# Altium schematic sheet TG21_TX_Xu ly ma tran phim.SchDoc
size A3; SheetNumber: 5; SheetTotal: 6
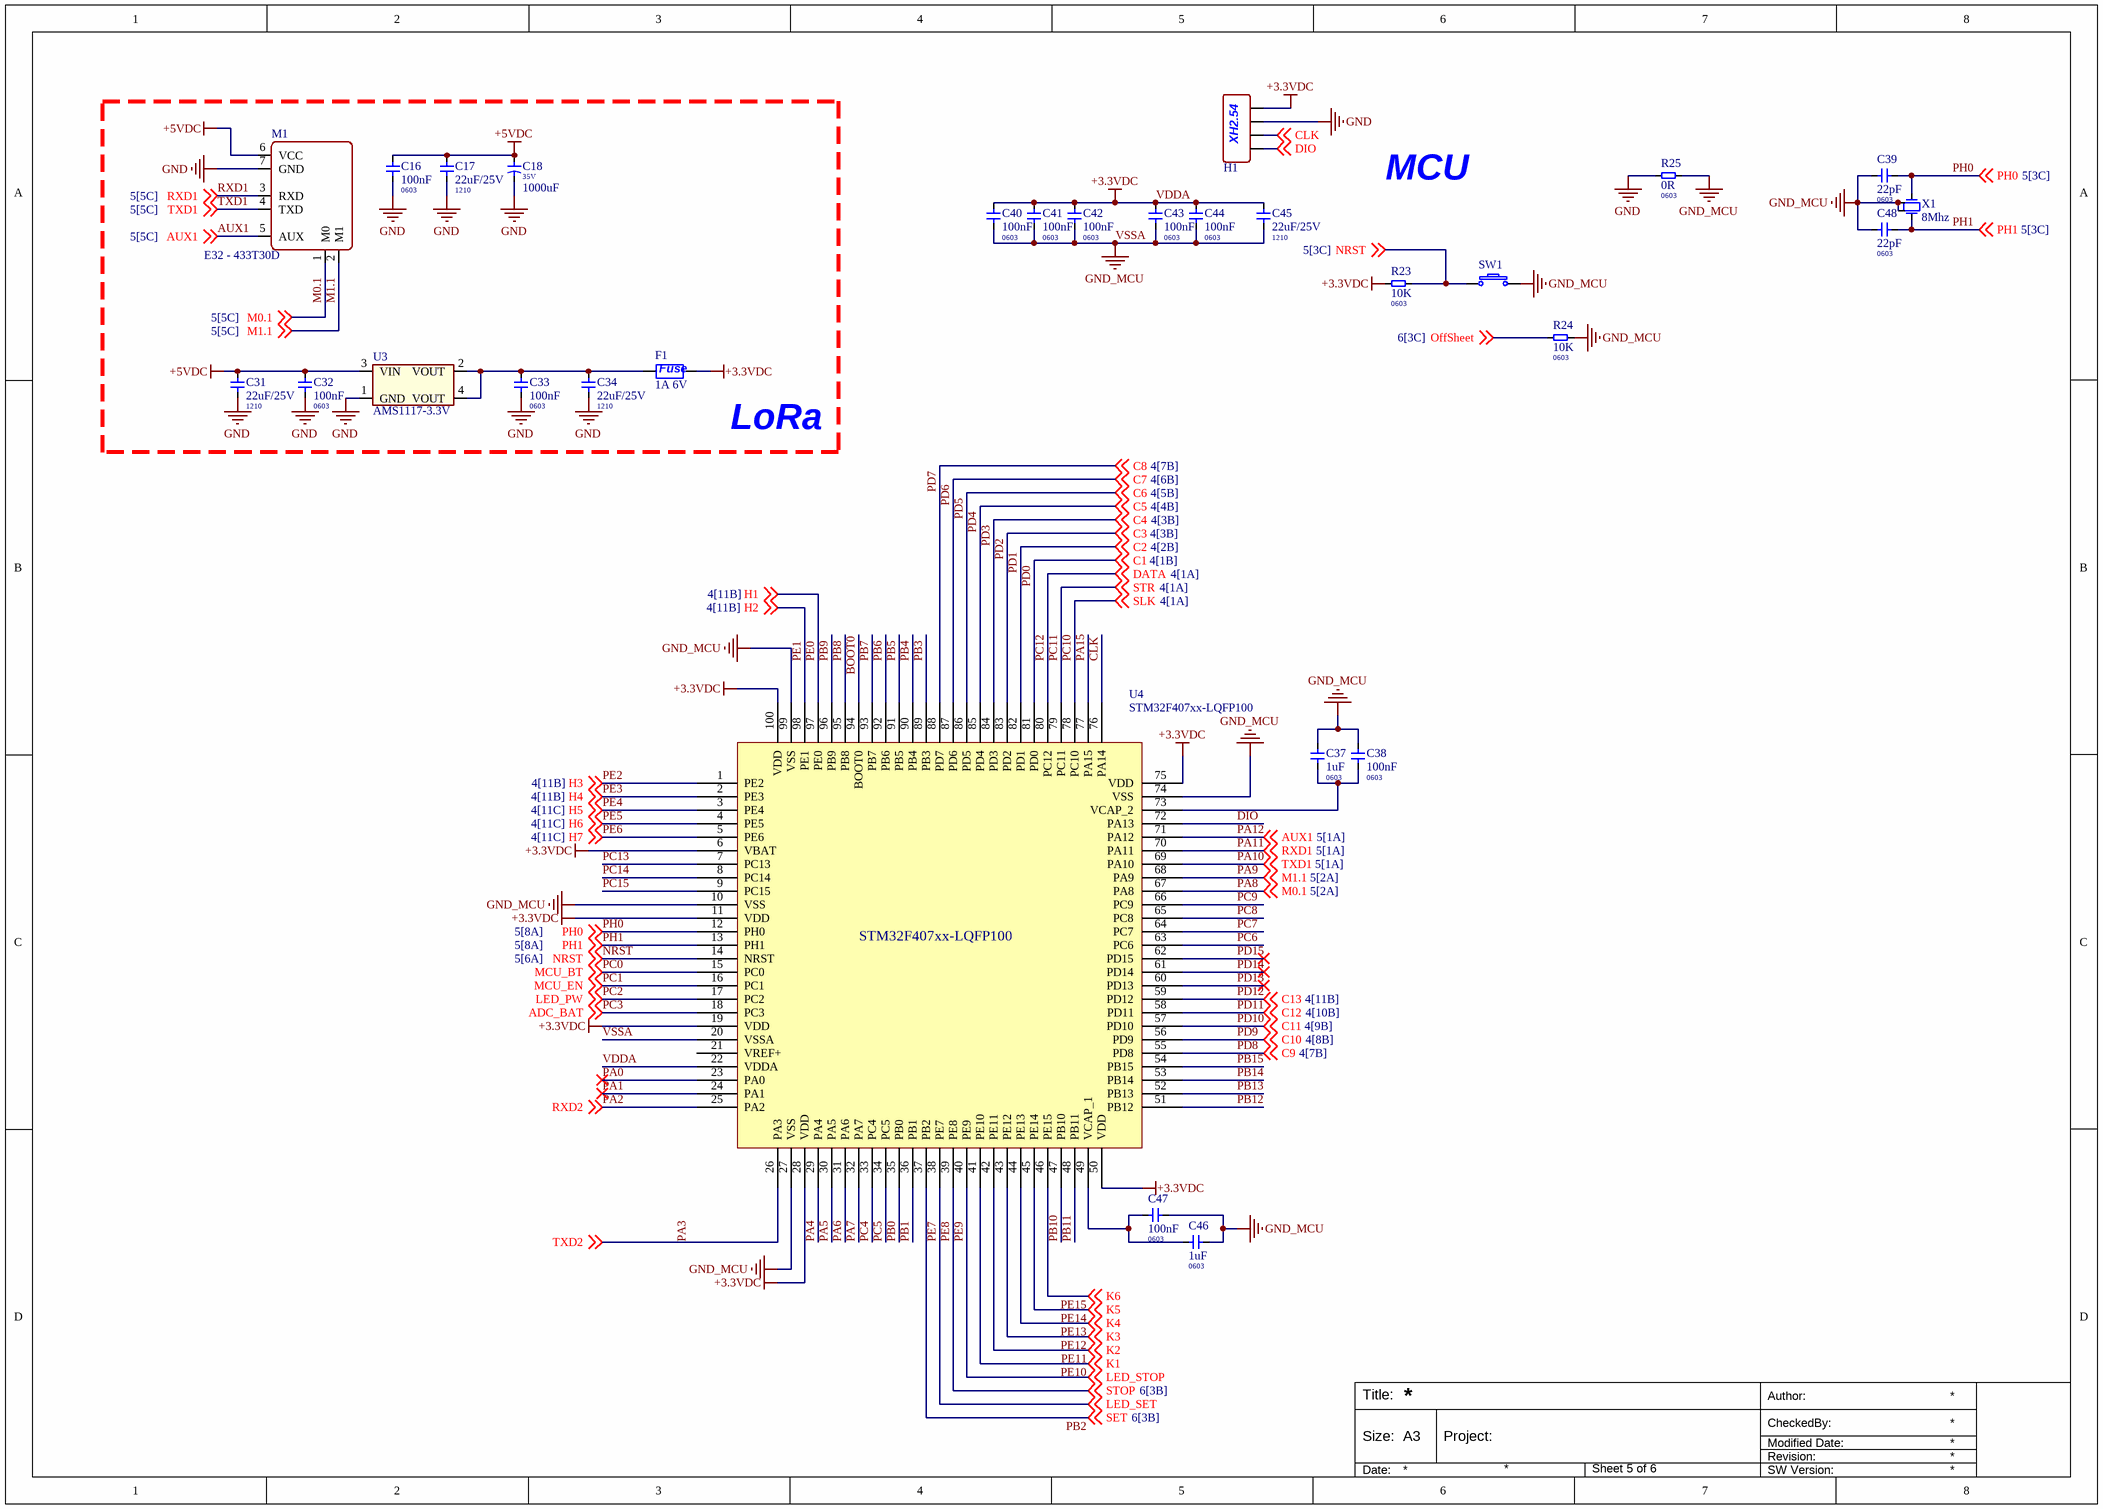
[diagram p0: TG21_TX_Xu ly ma tran phim.SchDoc]

## Parts
C16  100nF  Package: 0603  [0603 MLCC]
C17  22uF/25V  Package: 1210  [1210 CAPACITOR]
C18  Voltage: 35V  Capacitor: 1000uF  [10x20 5.0 Capacitor]  (hidden comment: 1000uF/35V)
C31  22uF/25V  Package: 1210  [1210 CAPACITOR]
C32  100nF  Package: 0603  [0603 MLCC]
C33  100nF  Package: 0603  [0603 MLCC]
C34  22uF/25V  Package: 1210  [1210 CAPACITOR]
C37  1uF  Package: 0603  [0603 MLCC]
C38  100nF  Package: 0603  [0603 MLCC]
C39  22pF  Package: 0603  [0603 MLCC]
C40  100nF  Package: 0603  [0603 MLCC]
C41  100nF  Package: 0603  [0603 MLCC]
C42  100nF  Package: 0603  [0603 MLCC]
C43  100nF  Package: 0603  [0603 MLCC]
C44  100nF  Package: 0603  [0603 MLCC]
C45  22uF/25V  Package: 1210  [1210 CAPACITOR]
C46  1uF  Package: 0603  [0603 MLCC]
C47  100nF  Package: 0603  [0603 MLCC]
C48  22pF  Package: 0603  [0603 MLCC]
F1  1A 6V  [1206 - Fuse]
H1  XY-XH2.54-4PZZ  [XH2.54 - 4PZZ]  (value not drawn)
M1  E32 - 433T30D  [E32 - 433T30D]
R23  10K  Package: 0603  [0603 Resistors]
R24  10K  Package: 0603  [0603 Resistors]
R25  0R  Package: 0603  [0603 Resistors]
SW1  HX 3x6x2.5A-2.5N  [SW - 2P SMD]  (value not drawn)
U3  AMS1117-3.3V  [SOT223 - 4P]
U4  STM32F407xx-LQFP100  [STM32_LQFP100]
X1  8Mhz  [5032 4P]

## Blocks framed on the sheet
LoRa: C16-C18 C31-C34 F1 M1 U3

## Nets
+5VDC: C16.2 C17.2 C18.1 C31.1 C32.2 M1.6(VCC) U3.3(VIN)
GND: C16.1 C17.1 C18.2 C31.2 C32.1 C33.1 C34.2 H1.2 M1.7(GND) R25.1 U3.1(GND)
VDDA: C40.2 C41.2 C42.2 C43.2 C44.2 C45.1 F1.2 H1.1 R23.1 U4.6(VBAT) U4.11(VDD) U4.19(VDD) U4.22(VDDA) U4.28(VDD) U4.50(VDD) U4.75(VDD) U4.100(VDD)  [also labelled +3.3VDC]
VSSA: C37.1 C38.1 C39.2 C40.1 C41.1 C42.1 C43.1 C44.1 C45.2 C46.1 C47.1 C48.2 R24.1 R25.2 SW1.2 U4.10(VSS) U4.20(VSSA) U4.27(VSS) U4.74(VSS) U4.99(VSS) X1.2 X1.4  [also labelled GND_MCU]
AUX1: M1.5(AUX) U4.71(PA12) ; off-sheet AUX1  [also labelled PA12]
BOOT0: U4.94(BOOT0)
CLK: H1.3 U4.76(PA14) ; off-sheet CLK
DIO: H1.4 U4.72(PA13) ; off-sheet DIO
M0.1: M1.1(M0) U4.67(PA8) ; off-sheet M0.1  [also labelled PA8]
M1.1: M1.2(M1) U4.68(PA9) ; off-sheet M1.1  [also labelled PA9]
NRST: R23.2 SW1.1 U4.14(NRST) ; off-sheet NRST
OffSheet: R24.2 ; off-sheet OffSheet
PA0: U4.23(PA0)
PA1: U4.24(PA1)
PA2: U4.25(PA2) ; off-sheet RXD2  [also labelled RXD2]
PA3: U4.26(PA3) ; off-sheet TXD2  [also labelled TXD2]
PA4: U4.29(PA4)
PA5: U4.30(PA5)
PA6: U4.31(PA6)
PA7: U4.32(PA7)
PA10: M1.4(TXD) U4.69(PA10) ; off-sheet TXD1  [also labelled TXD1]
PA11: M1.3(RXD) U4.70(PA11) ; off-sheet RXD1  [also labelled RXD1]
PA15: U4.77(PA15)
PB0: U4.35(PB0)
PB1: U4.36(PB1)
PB2: U4.37(PB2) ; off-sheet SET  [also labelled SET]
PB3: U4.89(PB3)
PB4: U4.90(PB4)
PB5: U4.91(PB5)
PB6: U4.92(PB6)
PB7: U4.93(PB7)
PB8: U4.95(PB8)
PB9: U4.96(PB9)
PB10: U4.47(PB10)
PB11: U4.48(PB11)
PB12: U4.51(PB12)
PB13: U4.52(PB13)
PB14: U4.53(PB14)
PB15: U4.54(PB15)
PC0: U4.15(PC0) ; off-sheet MCU_BT  [also labelled MCU_BT]
PC1: U4.16(PC1) ; off-sheet MCU_EN  [also labelled MCU_EN]
PC2: U4.17(PC2) ; off-sheet LED_PW  [also labelled LED_PW]
PC3: U4.18(PC3) ; off-sheet ADC_BAT  [also labelled ADC_BAT]
PC4: U4.33(PC4)
PC5: U4.34(PC5)
PC6: U4.63(PC6)
PC7: U4.64(PC7)
PC8: U4.65(PC8)
PC9: U4.66(PC9)
PC10: U4.78(PC10) ; off-sheet SLK  [also labelled SLK]
PC11: U4.79(PC11) ; off-sheet STR  [also labelled STR]
PC12: U4.80(PC12) ; off-sheet DATA  [also labelled DATA]
PC13: U4.7(PC13)
PC14: U4.8(PC14)
PC15: U4.9(PC15)
PD0: U4.81(PD0) ; off-sheet C1  [also labelled C1]
PD1: U4.82(PD1) ; off-sheet C2  [also labelled C2]
PD2: U4.83(PD2) ; off-sheet C3  [also labelled C3]
PD3: U4.84(PD3) ; off-sheet C4  [also labelled C4]
PD4: U4.85(PD4) ; off-sheet C5  [also labelled C5]
PD5: U4.86(PD5) ; off-sheet C6  [also labelled C6]
PD6: U4.87(PD6) ; off-sheet C7  [also labelled C7]
PD7: U4.88(PD7) ; off-sheet C8  [also labelled C8]
PD8: U4.55(PD8) ; off-sheet C9  [also labelled C9]
PD9: U4.56(PD9) ; off-sheet C10  [also labelled C10]
PD10: U4.57(PD10) ; off-sheet C11  [also labelled C11]
PD11: U4.58(PD11) ; off-sheet C12  [also labelled C12]
PD12: U4.59(PD12) ; off-sheet C13  [also labelled C13]
PD13: U4.60(PD13)
PD14: U4.61(PD14)
PD15: U4.62(PD15)
PE0: U4.97(PE0) ; off-sheet H1  [also labelled H1]
PE1: U4.98(PE1) ; off-sheet H2  [also labelled H2]
PE2: U4.1(PE2) ; off-sheet H3  [also labelled H3]
PE3: U4.2(PE3) ; off-sheet H4  [also labelled H4]
PE4: U4.3(PE4) ; off-sheet H5  [also labelled H5]
PE5: U4.4(PE5) ; off-sheet H6  [also labelled H6]
PE6: U4.5(PE6) ; off-sheet H7  [also labelled H7]
PE7: U4.38(PE7) ; off-sheet LED_SET  [also labelled LED_SET]
PE8: U4.39(PE8) ; off-sheet STOP  [also labelled STOP]
PE9: U4.40(PE9) ; off-sheet LED_STOP  [also labelled LED_STOP]
PE10: U4.41(PE10) ; off-sheet K1  [also labelled K1]
PE11: U4.42(PE11) ; off-sheet K2  [also labelled K2]
PE12: U4.43(PE12) ; off-sheet K3  [also labelled K3]
PE13: U4.44(PE13) ; off-sheet K4  [also labelled K4]
PE14: U4.45(PE14) ; off-sheet K5  [also labelled K5]
PE15: U4.46(PE15) ; off-sheet K6  [also labelled K6]
PH0: C39.1 U4.12(PH0) X1.3 ; off-sheet PH0
PH1: C48.1 U4.13(PH1) X1.1 ; off-sheet PH1
NetC33_2: C33.2 C34.1 F1.1 U3.2(VOUT) U3.4(VOUT)
NetC37_2: C37.2 C38.2 U4.73(VCAP_2)
NetC46_2: C46.2 C47.2 U4.49(VCAP_1)

Not connected (* = marked no-connect by the designer): U4 21(VREF+)

## Notes on the sheet
- MCU
- Author:
- Title:
- Size:
- A3
- Project:
- Revision:
- Modified Date:
- CheckedBy:
- Date:
- SW Version:
- (in symbol XH2.54 4PZZ) XH2.54

## Library data of the parts
C16 C32 C33 C38 C40-C44 C47 = 0603 100nF: 100nF ±10% 50V Ceramic Capacitor X7R 0603; Manufacturer: YAGEO; Mfr. Part #: CC0603KRX7R9BB104; LCSC Part #: C14663; ComponentLink1Description: LCSC Link; ComponentLink1URL: https://www.lcsc.com/product-detail/C14663.html?s_z=n_0603%2520100nF
C17 C31 C34 C45 = 1210 22uF 25V X7R: 22uF ±10% 25V Ceramic Capacitor X7R 1210; Manufacturer: Samsung Electro-Mechanics; Mfr. Part #: CL32B226KAJNNNE; LCSC Part #: C309062; ComponentLink1Description: LCSC Link; ComponentLink1URL: https://www.lcsc.com/product-detail/C309062.html?s_z=n_22uF%25201210
C18 = 10x20 1000uF 35V: 1000uF 35V Aluminum Electrolytic Capacitors Through Hole,D10xL20mm 2000hrs@105℃; Manufacturer: Rubycon; Mfr. Part #: 35PX1000MEFC10X20; LCSC Part #: C136014; ComponentLink1Description: LCSC Link; ComponentLink1URL: https://www.lcsc.com/product-detail/C136014.html?s_z=n_35V%25201000uF%2520rubycon; Package: Through Hole,D10xL20mm; Type: Capacitor; Assembly Type: DIP Assembly
C37 C46 = 0603 1uF: 1uF ±10% 50V Ceramic Capacitor X5R 0603; Manufacturer: Samsung Electro-Mechanics; Mfr. Part #: CL10A105KB8NNNC; LCSC Part #: C15849; ComponentLink1Description: LCSC Link; ComponentLink1URL: https://www.lcsc.com/product-detail/C15849.html?s_z=n_1uF%25200603%25201%2525&spm=wm.ssy.bg.0.xh&lcsc_vid=FVcIBVBRElIPBFdUFgBYX10HEQJbUQVVQANfV1wFQQcxVlNRQlFeXlNXT1hdUDsOAxUeFF5JWBYZEEoKFBINSQcJGk4%3D
C39 C48 = 0603 22pF: 22pF ±5% 50V Ceramic Capacitor C0G 0603; Manufacturer: Samsung Electro-Mechanics; Mfr. Part #: CL10C220JB8NNNC; LCSC Part #: C1653; ComponentLink1Description: LCSC Link; ComponentLink1URL: https://www.lcsc.com/product-detail/C1653.html?s_z=n_22pF%252050V%25200603
F1 = 1206 Fuse 1A 6V: Polymeric PTC Resettable Fuse 6V 1A Surface Mount 1206; Manufacturer: BHFUSE; Mfr. Part #: BSMD1206-100-6V; LCSC Part #: C883129; Package: 1206; ComponentLink1Description: LCSC Link; ComponentLink1URL: https://www.lcsc.com/product-detail/C883129.html?s_z=n_q_Resettable%2520Fuse%25206V%25201A%25201206&spm=wm.fly.bg.0.xh&lcsc_vid=QQBdBlYAQFFWUgBXTlUPAgFQQQIIBQIHEQIPAgJRQFAxVlNRT1daVVdeT1JfUzsOAxUeFF5JWBYZEEoKFBINSQcJGk4NBhADEA4cHktXRVZADxALGw%3D%3D; ComponentLink2Description: Datasheet; ComponentLink2URL: NO; Type: Fuse; Assembly Type: SMT Assembly
H1 = XH2.54 4PZZ: XH 1 4P -25℃~+85℃ 2.54mm 4 2A 250V 1x4P Through Hole,P=2.54mm Headers, Male Pins RoHS; Manufacturer: XYECONN; Mfr. Part #: XY-XH2.54-4PZZ; LCSC Part #: C53201003; ComponentLink1Description: LCSC Link; ComponentLink1URL: https://www.lcsc.com/product-detail/C53201003.html?s_z=n_XH2.54%25204P; Package: Through Hole,P=2.54mm; Type: Header; Assembly Type: DIP Assembly; ComponentLink2Description: Datasheet; ComponentLink2URL: https://www.lcsc.com/datasheet/C53201003.pdf
M1 = E32 - 433T30D: 8km UART Through Hole RF Transceiver Modules and Modems RoHS; Manufacturer: EBYTE; Mfr. Part #: E32-433T30D; LCSC Part #: C97351; Package: Through Hole; Type: Module; ComponentLink1Description: LCSC Link; ComponentLink1URL: https://www.lcsc.com/product-detail/C97351.html?s_z=n_E32%2520433T30D; ComponentLink2Description: Datasheet; ComponentLink2URL: https://www.lcsc.com/datasheet/C97351.pdf
R23 R24 = 0603 10K: 100mW 10kΩ 75V Thick Film Resistor ±1% ±100ppm/℃ 0603 Chip Resistor - Surface Mount RoHS; Manufacturer: VISHAY; Mfr. Part #: CRCW060310K0FKEA; LCSC Part #: C844918; ComponentLink1Description: LCSC Link; ComponentLink1URL: https://www.lcsc.com/product-detail/C844918.html?s_z=n_10K
R25 = 0603 0R: 100mW 0Ω 75V Thick Film Resistor ±1% ±100ppm/℃ 0603 Chip Resistor - Surface Mount RoHS; Mfr. Part #: RC0603FR-070RL; Manufacturer: YAGEO; LCSC Part #: C100044; ComponentLink1Description: LCSC Link; ComponentLink1URL: https://www.lcsc.com/product-detail/C100044.html?s_z=n_0R%25201%2525%25200603&spm=wm.ssy.bg.1.xh&lcsc_vid=FVcIBVBRElIPBFdUFgBYX10HEQJbUQVVQANfV1wFQQcxVlNRQ1RWVFVVRFVbUzsOAxUeFF5JWBYZEEoKFBINSQcJGk4dAgUUFAk%3D; Value: 0R
SW1 = Switch Tactile 3x6x2.5: Tactile Switch SPST 250gf 2.5mm SMD (SMT) Tab 6mm x 3.6mm Surface Mount; Manufacturer: hanxia; Mfr. Part #: HX 3x6x2.5A-2.5N; LCSC Part #: C36498960; Package: SMD,6x3mm; ComponentLink1Description: LCSC Link; ComponentLink1URL: https://www.lcsc.com/product-detail/C36498960.html?s_z=n_q_p_3x6x2.5&spm=wm.ssy.bg.0.xh&lcsc_vid=QQBdBlYAQFFWUgBXTlUPAgFQQQIIBQIHEQIPAgJRQFAxVlNRT1daU1NWQVBbVTsOAxUeFF5JWBYZEEoKFBINSQcJGk4NBhADEA4cHktXRVZADxALGw%3D%3D; ComponentLink2Description: Datasheet; ComponentLink2URL: https://www.lcsc.com/datasheet/C36498960.pdf?spm=wm.sxq.inf.ggs___wm.ssy.bg.0.xh&lcsc_vid=QQBdBlYAQFFWUgBXTlUPAgFQQQIIBQIHEQIPAgJRQFAxVlNRT1daU1NWQVBbVTsOAxUeFF5JWBYZEEoKFBINSQcJGk4NBhADEA4cHktXRVZADxALGw%3D%3D; Type: Switch; Assembly Type: SMT Assembly
U3 = AMS1117: 1.2A Fixed 3.3V Positive 15V SOT-223 Voltage Regulators - Linear, Low Drop Out (LDO) Regulators ROHS
X1 = Crystal 5032 4P 8MhZ: Crystal 8MHz ±20ppm 12pF SMD5032-4P; Manufacturer: SOSET; Mfr. Part #: 5032 8M 12PF 20PPM 4P; LCSC Part #: C5181482; Package: SMD5032-4P; ComponentLink1Description: LCSC Link; ComponentLink1URL: https://www.lcsc.com/product-detail/C5181482.html?s_z=n_5032%25208m